# Altium schematic sheet ltc1474.SchDoc
size A4; Organization: UNSW Solar Racing Team; Address3: UNSW; Address4: Sydney NSW 2052; Address2: Electrical Engineering; Address1: Rm 109
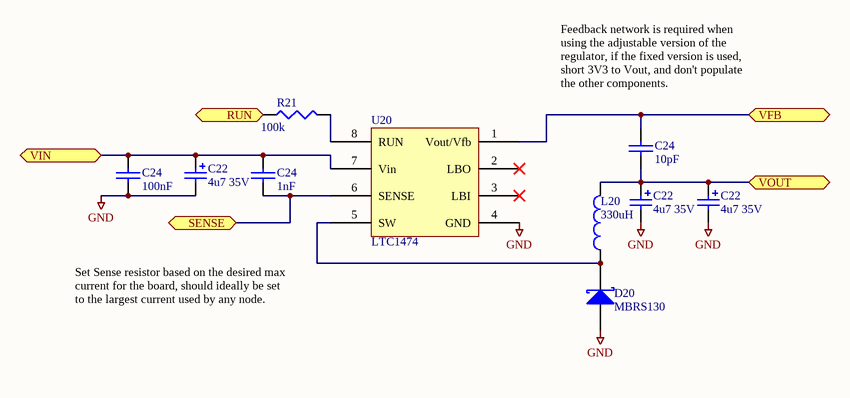
[diagram p0: ltc1474.SchDoc]

## Parts
(Parts that share a designator on the sheet are numbered #1, #2 ... from top to bottom, then left to right.)
C22#1  4u7 35V  [1812]
C22#2  4u7 35V  [1812]
C22#3  4u7 35V  [1812]
C24#1  10pF  [0603]
C24#2  100nF  [0603]
C24#3  1nF  [0603]
D20  MBRS130  [SMB]
L20  330uH  [1812]
R21  100k  [0603]
U20  LTC1474  [SO8]

## Ports
RUN (in), SENSE, VFB, VIN, VOUT

## Nets
GND: C22#1.2 C22#2.2 C22#3.2 C24#2.2 D20.A U20.4(GND)
RUN: R21.1 ; port RUN
SENSE: C24#3.2 U20.6(SENSE) ; port SENSE
VFB: C24#1.1 U20.1(Vout/Vfb) ; port VFB
VIN: C22#1.1 C24#2.1 C24#3.1 U20.7(Vin) ; port VIN
VOUT: C22#2.1 C22#3.1 C24#1.2 L20.2 ; port VOUT
NetD20_K: D20.K L20.1 U20.5(SW)
NetR21_2: R21.2 U20.8(RUN)

Not connected (* = marked no-connect by the designer): U20 2(LBO)* 3(LBI)*

## Notes on the sheet
- Feedback network is required when using the adjustable version of the regulator, if the fixed version is used, short 3V3 to Vout, and don't populate the other components.
- Set Sense resistor based on the desired max current for the board, should ideally be set to the largest current used by any node.
- Title
- Size:
- Date:
- A4
- Number:
- Time:
- Revision:
- Sheet
- of
- File:

## Library data of the parts
C22#1-C22#3 = Cap Pol3: Polarized Capacitor (Surface Mount); Value: 4.7uF; Revision: July-2002: Re-released for DXP Platform.; Farnell: 967-294; Price: 1.97
C24#1 C24#3 = CAP: Capacitor; Value: 100nF; Needed?: NO - HW LAB
C24#2 = CAP: Capacitor; Needed?: NO - HW LAB; Value: 100nF
D20 = D SCHOTTKY: Schottky Diode; Revision: July-2002: Re-released for DXP Platform.; Farnell: 708-150; Price: 1.49
L20 = Inductor: Revision: July-2002: Re-released for DXP Platform.; Value: 330uH; Farnell: 200-451; Price: 2.90
R21 = RES1: Resistor; Value: 100k; Farnell: 612-728; Price: 0.13
U20 = LTC1474: Step-down converter; Farnell: NA